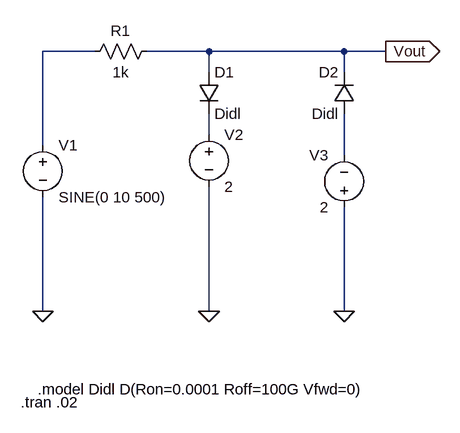
[diagram p0: schematic Q1c.asc]
Q1c.asc, the LTspice schematic file:
Version 4
SHEET 1 880 680
WIRE 64 64 -16 64
WIRE 240 64 144 64
WIRE 448 64 240 64
WIRE 512 64 448 64
WIRE 240 96 240 64
WIRE 448 96 448 64
WIRE 240 192 240 160
WIRE -16 208 -16 64
WIRE 448 224 448 160
WIRE -16 464 -16 288
WIRE 240 464 240 272
WIRE 448 464 448 304
FLAG -16 464 0
FLAG 240 464 0
FLAG 448 464 0
FLAG 512 64 Vout
IOPIN 512 64 Out
SYMBOL voltage -16 192 R0
WINDOW 123 0 0 Left 0
WINDOW 39 0 0 Left 0
SYMATTR InstName V1
SYMATTR Value SINE(0 10 500)
SYMBOL voltage 240 176 R0
WINDOW 123 0 0 Left 0
WINDOW 39 0 0 Left 0
SYMATTR InstName V2
SYMATTR Value 2
SYMBOL voltage 448 320 R180
WINDOW 0 24 96 Left 2
WINDOW 3 24 16 Left 2
WINDOW 123 0 0 Left 0
WINDOW 39 0 0 Left 0
SYMATTR InstName V3
SYMATTR Value 2
SYMBOL diode 224 96 R0
SYMATTR InstName D1
SYMATTR Value Didl
SYMBOL diode 464 160 R180
WINDOW 0 24 64 Left 2
WINDOW 3 24 0 Left 2
SYMATTR InstName D2
SYMATTR Value Didl
SYMBOL res 160 48 R90
WINDOW 0 0 56 VBottom 2
WINDOW 3 32 56 VTop 2
SYMATTR InstName R1
SYMATTR Value 1k
TEXT -24 584 Left 2 !.model Didl D(Ron=0.0001 Roff=100G Vfwd=0)
TEXT -50 604 Left 2 !.tran .02

The netlist it stands for:
* Q1c.asc
V1 N001 0 SINE(0 10 500)
V2 N002 0 2
V3 0 N003 2
D1 Vout N002 Didl
D2 N003 Vout Didl
R1 Vout N001 1k
.model D D
.lib standard.dio
.model Didl D(Ron=0.0001 Roff=100G Vfwd=0)
.tran .02
.backanno
.end